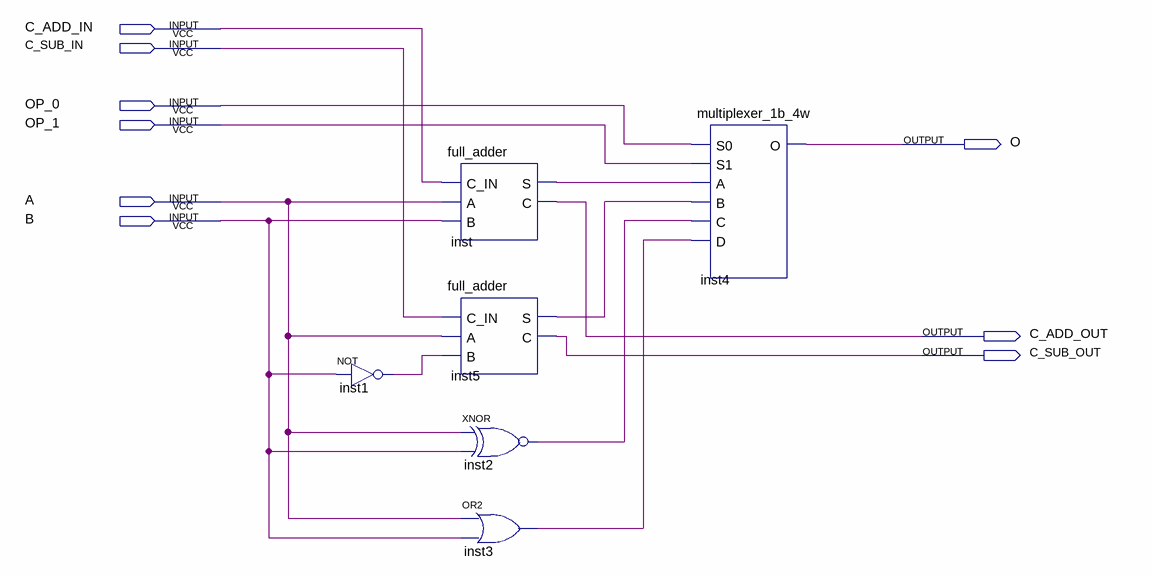
[diagram p0: schematic sheet]
// Quartus schematic alu_1b.bdf as structural Verilog: 6 symbols, 9 pins
module alu_1b (
  input  C_ADD_IN,
  input  C_SUB_IN,
  input  OP_0,
  input  OP_1,
  input  A,
  input  B,
  output O,
  output C_ADD_OUT,
  output C_SUB_OUT
);

  wire inst1_out, inst2_out, inst3_out, inst5_s, inst_s;

  not inst1 (inst1_out, B);
  full_adder inst (.C_IN(C_ADD_IN), .A(A), .B(B), .S(inst_s), .C(C_ADD_OUT));
  full_adder inst5 (.C_IN(C_SUB_IN), .A(A), .B(inst1_out), .S(inst5_s), .C(C_SUB_OUT));
  xnor inst2 (inst2_out, A, B);
  or inst3 (inst3_out, A, B);
  multiplexer_1b_4w inst4 (.S0(OP_0), .S1(OP_1), .A(inst_s), .B(inst5_s), .C(inst2_out), .D(inst3_out), .O(O));
endmodule
